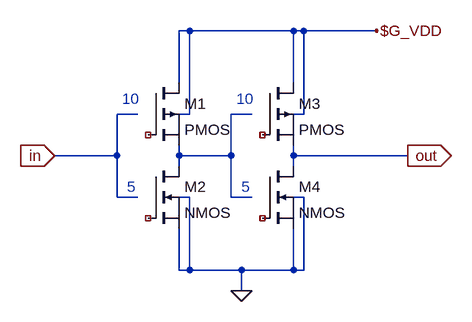
[diagram p0: schematic buffer.asc]
buffer.asc, the LTspice schematic file:
Version 4
SHEET 1 1292 836
WIRE -608 -128 -624 -128
WIRE -448 -128 -608 -128
WIRE -432 -128 -448 -128
WIRE -320 -128 -432 -128
WIRE -624 -48 -624 -128
WIRE -448 -48 -448 -128
WIRE -688 0 -720 0
WIRE -608 0 -608 -128
WIRE -608 0 -624 0
WIRE -512 0 -544 0
WIRE -432 0 -432 -128
WIRE -432 0 -448 0
WIRE -720 64 -720 0
WIRE -720 64 -816 64
WIRE -624 64 -624 48
WIRE -544 64 -544 0
WIRE -544 64 -624 64
WIRE -448 64 -448 48
WIRE -272 64 -448 64
WIRE -624 80 -624 64
WIRE -448 80 -448 64
WIRE -720 128 -720 64
WIRE -688 128 -720 128
WIRE -608 128 -624 128
WIRE -544 128 -544 64
WIRE -512 128 -544 128
WIRE -432 128 -448 128
WIRE -624 240 -624 176
WIRE -608 240 -608 128
WIRE -608 240 -624 240
WIRE -528 240 -608 240
WIRE -448 240 -448 176
WIRE -448 240 -528 240
WIRE -432 240 -432 128
WIRE -432 240 -448 240
WIRE -528 272 -528 240
FLAG -528 272 0
FLAG -816 64 in
IOPIN -816 64 In
FLAG -272 64 out
IOPIN -272 64 Out
FLAG -320 -128 $G_VDD
SYMBOL pmos -672 -48 R0
SYMATTR InstName M1
SYMATTR Value2 l=0.6u w=3u
SYMATTR SpiceModel ""
SYMATTR Value PMOS
SYMBOL nmos -672 80 R0
SYMATTR InstName M2
SYMATTR Value2 l=0.6u w=1.5u
SYMATTR SpiceModel ""
SYMATTR Value NMOS
SYMBOL pmos -496 -48 R0
SYMATTR InstName M3
SYMATTR Value2 l=0.6u w=3u
SYMATTR SpiceModel ""
SYMATTR Value PMOS
SYMBOL nmos -496 80 R0
SYMATTR InstName M4
SYMATTR Value2 l=0.6u w=1.5u
SYMATTR SpiceModel ""
SYMATTR Value NMOS
TEXT -712 -24 Left 0 ;10
TEXT -704 112 Left 0 ;5
TEXT -536 -24 Left 0 ;10
TEXT -528 112 Left 0 ;5

The netlist it stands for:
* buffer.asc
* M1: PMOS l=0.6u w=3u (symbol pmos not certain, pin order unknown); nets seen at it: $G_VDD, N001
* M2: NMOS l=0.6u w=1.5u (symbol nmos not certain, pin order unknown); nets seen at it: 0, N001
* M3: PMOS l=0.6u w=3u (symbol pmos not certain, pin order unknown); nets seen at it: $G_VDD, out
* M4: NMOS l=0.6u w=1.5u (symbol nmos not certain, pin order unknown); nets seen at it: 0, out
* 10
* 5
* 10
* 5
.backanno
.end